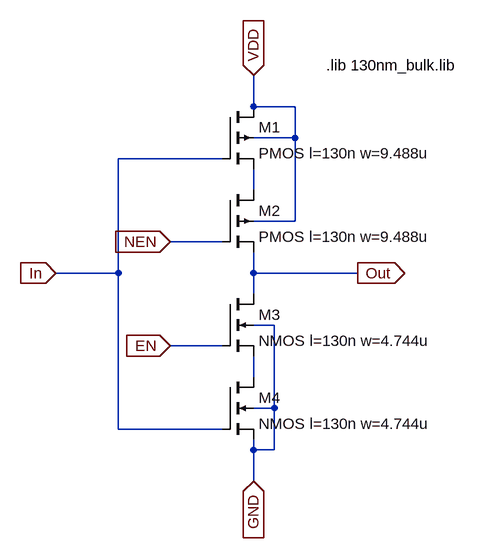
[diagram p0: schematic Tristate_Inv_B.asc]
Tristate_Inv_B.asc, the LTspice schematic file:
Version 4
SHEET 1 880 768
WIRE 208 80 208 32
WIRE 272 80 208 80
WIRE 272 128 272 80
WIRE 272 128 208 128
WIRE 160 160 0 160
WIRE 208 208 208 176
WIRE 272 256 272 128
WIRE 272 256 208 256
WIRE 160 288 80 288
WIRE 0 336 0 160
WIRE 0 336 -96 336
WIRE 208 336 208 304
WIRE 368 336 208 336
WIRE 208 368 208 336
WIRE 240 416 208 416
WIRE 160 448 80 448
WIRE 208 496 208 464
WIRE 240 544 240 416
WIRE 240 544 208 544
WIRE 0 576 0 336
WIRE 160 576 0 576
WIRE 208 608 208 592
WIRE 240 608 240 544
WIRE 240 608 208 608
WIRE 208 656 208 608
FLAG 208 32 VDD
IOPIN 208 32 In
FLAG 208 656 GND
IOPIN 208 656 In
FLAG -96 336 In
IOPIN -96 336 In
FLAG 80 288 NEN
IOPIN 80 288 In
FLAG 80 448 EN
IOPIN 80 448 In
FLAG 368 336 Out
IOPIN 368 336 Out
SYMBOL pmos4 160 80 R0
SYMATTR InstName M1
SYMATTR Value2 l=130n w=9.488u
SYMATTR Value PMOS l=130n w=9.488u
SYMBOL pmos4 160 208 R0
SYMATTR InstName M2
SYMATTR Value2 l=130n w=9.488u
SYMATTR Value PMOS l=130n w=9.488u
SYMBOL nmos4 160 368 R0
SYMATTR InstName M3
SYMATTR Value2 l=130n w=4.477u
SYMATTR Value NMOS l=130n w=4.744u
SYMBOL nmos4 160 496 R0
SYMATTR InstName M4
SYMATTR Value2 l=130n w=4.744u
SYMATTR Value NMOS l=130n w=4.744u
TEXT 320 16 Left 2 !.lib 130nm_bulk.lib

The netlist it stands for:
* Tristate_Inv_B.asc
M1 VDD In N001 VDD PMOS l=130n w=9.488u l=130n w=9.488u
M2 N001 NEN Out VDD PMOS l=130n w=9.488u l=130n w=9.488u
M3 Out EN N002 GND NMOS l=130n w=4.744u l=130n w=4.477u
M4 N002 In GND GND NMOS l=130n w=4.744u l=130n w=4.744u
.model NMOS NMOS
.model PMOS PMOS
.lib standard.mos
.lib 130nm_bulk.lib
.backanno
.end